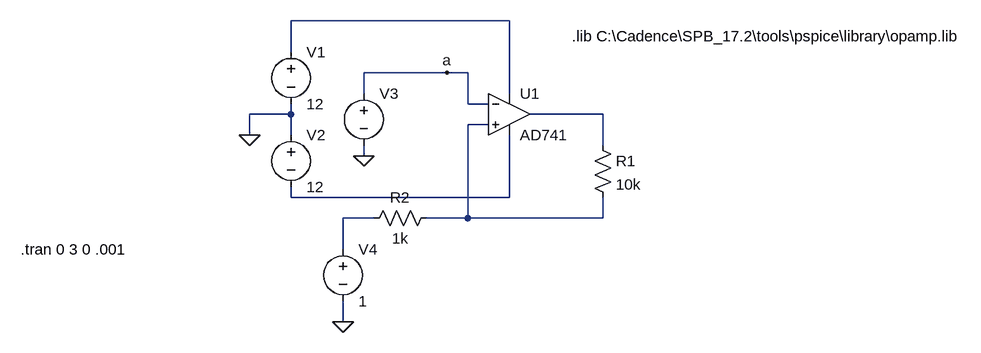
[diagram p0: schematic comp_hist.asc]
comp_hist.asc, the LTspice schematic file:
Version 4
SHEET 1 1244 680
WIRE 272 32 -64 32
WIRE -64 80 -64 32
WIRE 128 112 48 112
WIRE 176 112 128 112
WIRE 208 112 176 112
WIRE 48 144 48 112
WIRE 272 144 272 32
WIRE 208 160 208 112
WIRE 240 160 208 160
WIRE -64 176 -64 160
WIRE -64 176 -128 176
WIRE 416 176 304 176
WIRE 240 192 208 192
WIRE -128 208 -128 176
WIRE -64 208 -64 176
WIRE 416 224 416 176
WIRE 48 240 48 224
WIRE -64 304 -64 288
WIRE 272 304 272 208
WIRE 272 304 -64 304
WIRE 64 336 16 336
WIRE 208 336 208 192
WIRE 208 336 144 336
WIRE 416 336 416 304
WIRE 416 336 208 336
WIRE 16 384 16 336
WIRE 16 496 16 464
FLAG -128 208 0
FLAG 48 240 0
FLAG 176 112 a
FLAG 16 496 0
DATAFLAG 128 112 ""
SYMBOL Opamps\\opamp2 272 112 R0
SYMATTR InstName U1
SYMATTR Value AD741
SYMBOL voltage -64 64 R0
WINDOW 123 0 0 Left 2
WINDOW 39 0 0 Left 2
SYMATTR InstName V1
SYMATTR Value 12
SYMBOL voltage -64 192 R0
WINDOW 123 0 0 Left 2
WINDOW 39 0 0 Left 2
SYMATTR InstName V2
SYMATTR Value 12
SYMBOL res 400 208 R0
SYMATTR InstName R1
SYMATTR Value 10k
SYMBOL res 160 320 R90
WINDOW 0 0 56 VBottom 2
WINDOW 3 32 56 VTop 2
SYMATTR InstName R2
SYMATTR Value 1k
SYMBOL voltage 48 128 R0
WINDOW 3 24 96 Invisible 2
WINDOW 123 0 0 Left 2
WINDOW 39 0 0 Left 2
SYMATTR InstName V3
SYMATTR Value PWL(0 12 1 -12 2 12 3 -12)
SYMBOL voltage 16 368 R0
WINDOW 123 0 0 Left 2
WINDOW 39 0 0 Left 2
SYMATTR InstName V4
SYMATTR Value 1
TEXT -480 384 Left 2 !.tran 0 3 0 .001
TEXT 368 56 Left 2 !.lib C:\\Cadence\\SPB_17.2\\tools\\pspice\\library\\opamp.lib

The netlist it stands for:
* comp_hist.asc
XU1 N003 a N001 N004 N002 AD741  ; pins In+ In- V+ V- OUT
V1 N001 0 12
V2 0 N004 12
R1 N002 N003 10k
R2 N003 N005 1k
V3 a 0 PWL(0 12 1 -12 2 12 3 -12)
V4 N005 0 1
.tran 0 3 0 .001
.lib C:\Cadence\SPB_17.2\tools\pspice\library\opamp.lib
.backanno
.end